# Altium project SMARTBOX.PrjPCB
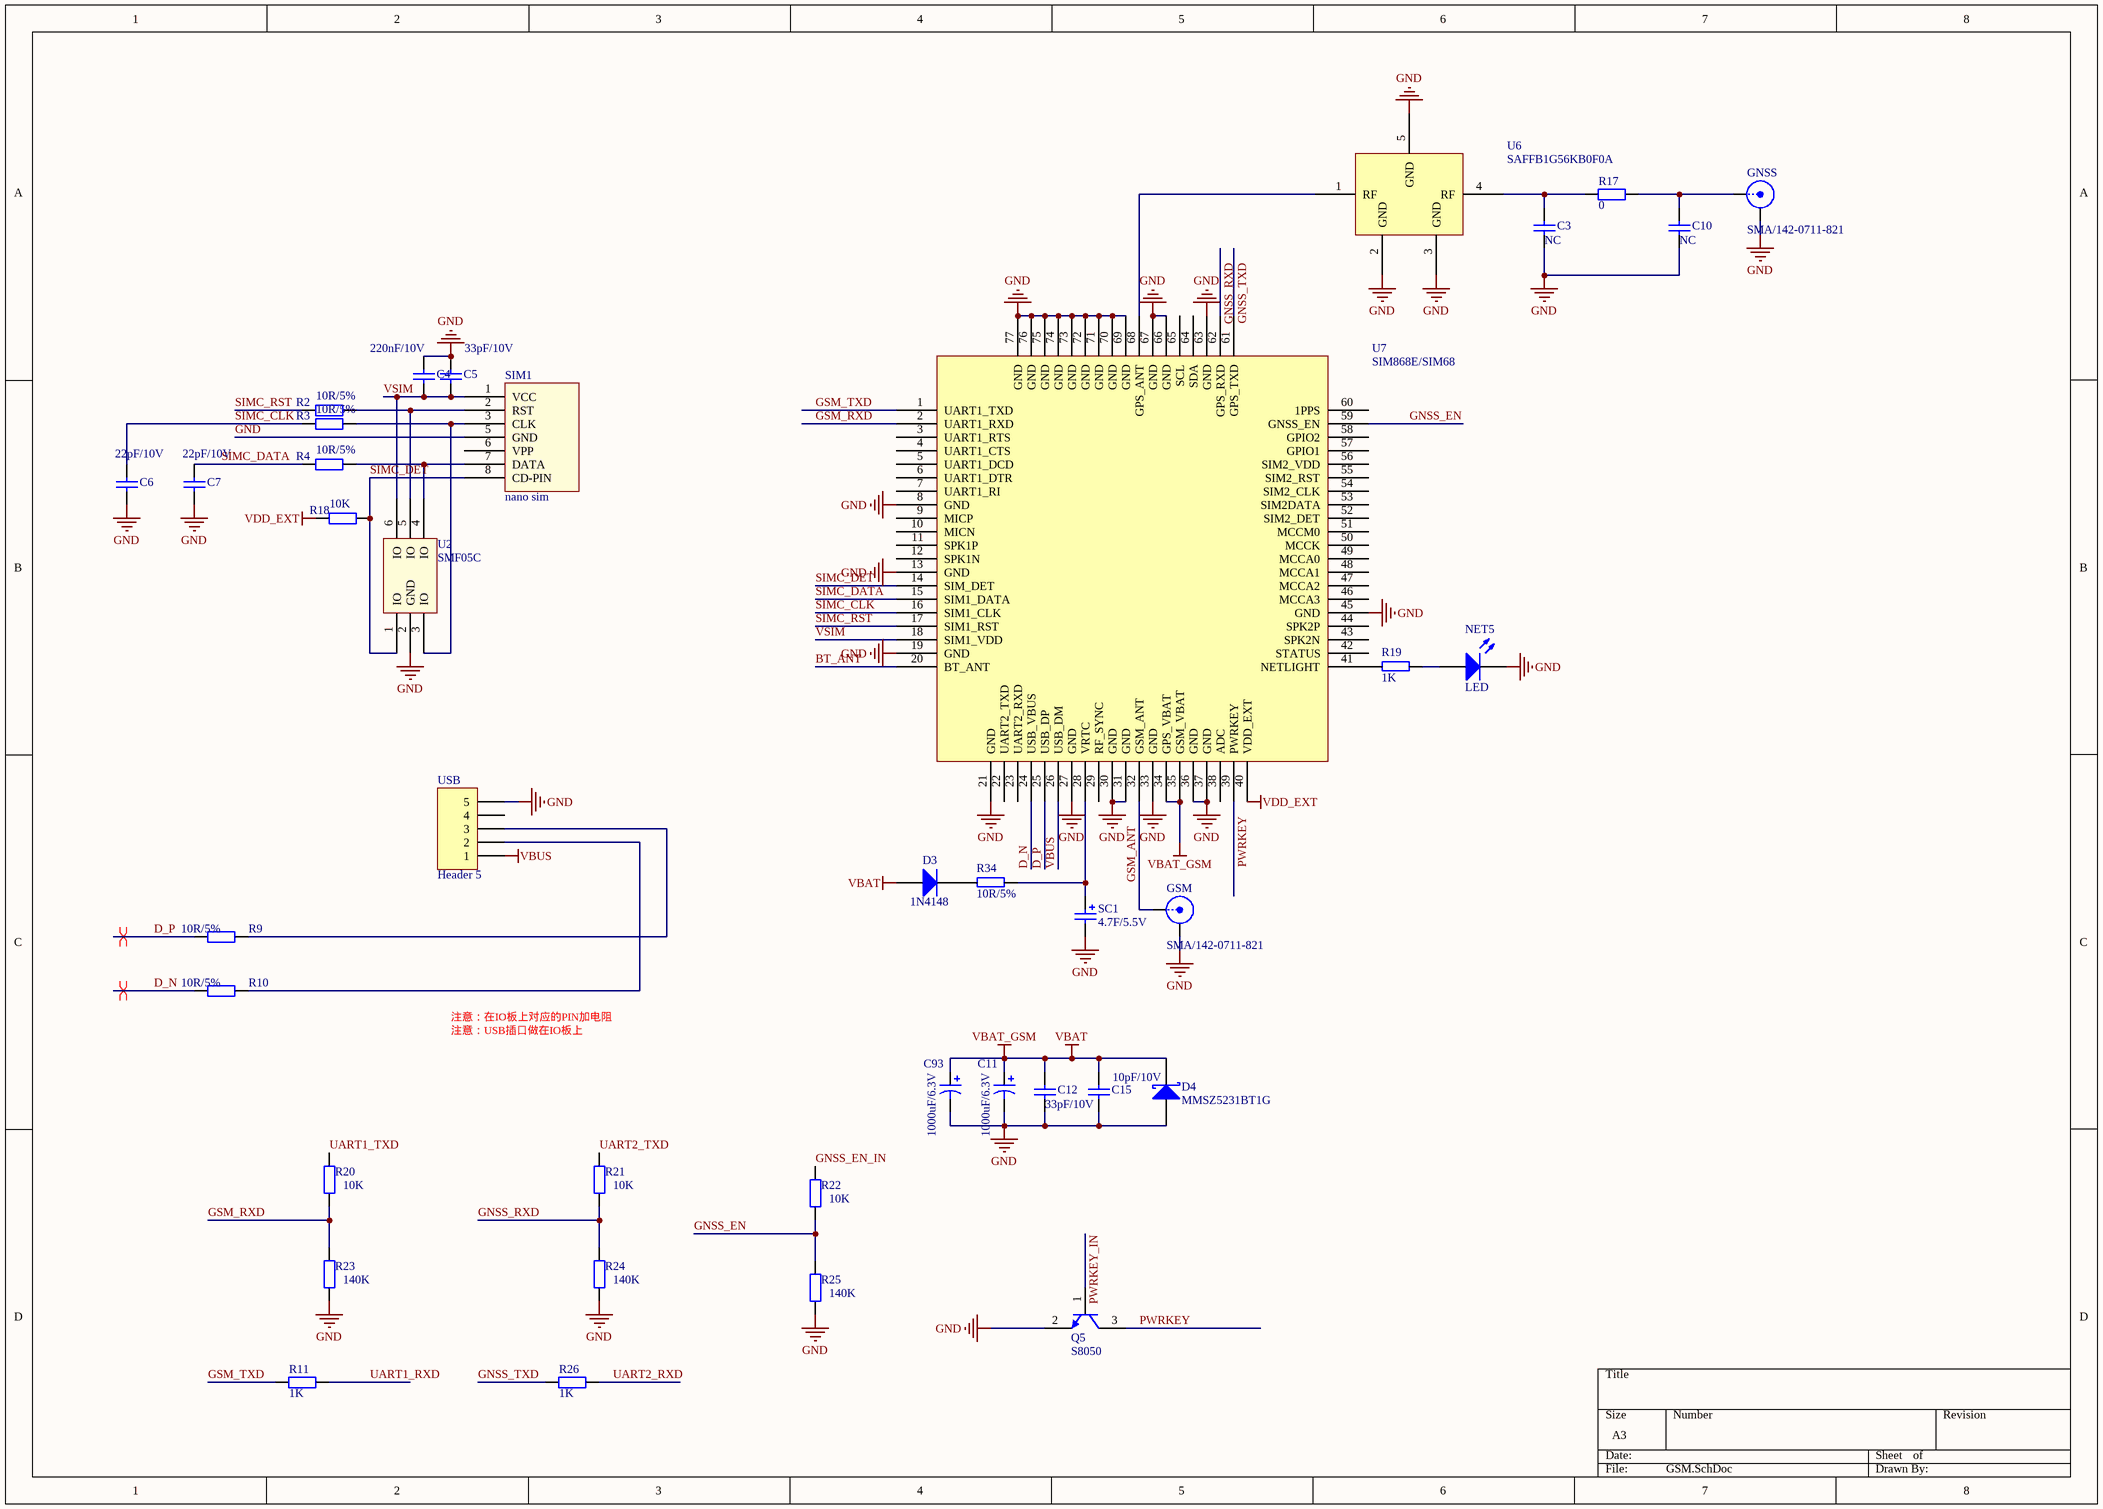
[diagram p0: GSM.SchDoc]
3 sheets, 91 parts. Net scope: global (net labels, ports and power ports of the same name join across sheets).
Board file: smartbox.PcbDoc
Sheets:
  GSM.SchDoc
  POWER.SchDoc
  CPU.SchDoc

## Sheet GSM.SchDoc
size A3

### Parts
C3  NC  [0603C]
C4  220nF/10V  [0603C]
C5  33pF/10V  [0603C]
C6  22pF/10V  [0603C]
C7  22pF/10V  [0603C]
C10  NC  [0603C]
C11  1000uF/6.3V  [7343]
C12  33pF/10V  [0603C]
C15  10pF/10V  [0603C]
C93  1000uF/6.3V  [7343]
D3  1N4148  [LL34]
D4  MMSZ5231BT1G  [SOD123]
GNSS  SMA/142-0711-821  [SMA END LAUNCH JACK RECEPTACLE SHORT]
GSM  SMA/142-0711-821  [SMA END LAUNCH JACK RECEPTACLE SHORT]
NET5  LED  [0603LED]
Q5  S8050  [SOT23-3]
R2  10R/5%  [0603R]
R3  10R/5%  [0603R]
R4  10R/5%  [0603R]
R9  10R/5%  [0603R]
R10  10R/5%  [0603R]
R11  1K  [0603R]
R17  0  [0603R]
R18  10K  [0603R]
R19  1K  [0603r]
R20  10K  [0603R]
R21  10K  [0603R]
R22  10K  [0603R]
R23  140K  [0603R]
R24  140K  [0603R]
R25  140K  [0603R]
R26  1K  [0603R]
R34  10R/5%  [0603r]
SC1  4.7F/5.5V  [SF-13.5*6.5]
SIM1  nano sim  [Nano SIM]
U2  SMF05C  [SC70-6L]
U6  SAFFB1G56KB0F0A  [SAFFB1G56KB0F0A]
U7  SIM868E/SIM68  [SIM868]
USB  Header 5  [Micro_USB_PH]

### Nets
GND: C3.2 C4.1 C5.1 C6.2 C7.2 C10.2 C11.2 C12.2 C15.2 C93.2 D4.A GNSS.2(GND) GSM.2(GND) NET5.2(K) Q5.2(E) R23.2 R24.2 R25.2 SC1.2 SIM1.5(GND) U2.2(GND) U6.2(GND) U6.3(GND) U6.5(GND) U7.8(GND) U7.13(GND) U7.19(GND) U7.21(GND) U7.27(GND) U7.30(GND) U7.31(GND) U7.33(GND) U7.36(GND) U7.37(GND) U7.45(GND) U7.63(GND) U7.66(GND) U7.67(GND) U7.69(GND) U7.70(GND) U7.71(GND) U7.72(GND) U7.73(GND) U7.74(GND) U7.75(GND) U7.76(GND) U7.77(GND) USB.5
VBAT: C11.1 C12.1 C15.1 C93.1 D3.1(A) D4.K U7.34(GPS_VBAT) U7.35(GSM_VBAT)  [also labelled VBAT_GSM]
VBUS: U7.26(USB_DM) USB.1
VDD_EXT: R18.2 U7.40(VDD_EXT)
BT_ANT: U7.20(BT_ANT)
D_N: R10.1 U7.24(USB_VBUS)
D_P: R9.1 U7.25(USB_DP)
GNSS_EN: R22.2 R25.1 U7.59(GNSS_EN)
GNSS_EN_IN: R22.1
GNSS_RXD: R21.2 R24.1 U7.62(GPS_RXD)
GNSS_TXD: R26.1 U7.61(GPS_TXD)
GSM_ANT: GSM.1(Signal) U7.32(GSM_ANT)
GSM_RXD: R20.2 R23.1 U7.2(UART1_RXD)
GSM_TXD: R11.1 U7.1(UART1_TXD)
PWRKEY: Q5.3(C) U7.39(PWRKEY)
PWRKEY_IN: Q5.1(B)
SIMC_CLK: C6.1 R3.2 U7.16(SIM1_CLK)
SIMC_DATA: C7.1 R4.2 U7.15(SIM1_DATA)
SIMC_DET: R18.1 SIM1.8(CD-PIN) U2.1(IO) U7.14(SIM_DET)
SIMC_RST: R2.2 U7.17(SIM1_RST)
UART1_RXD: R11.2
UART1_TXD: R20.1
UART2_RXD: R26.2
UART2_TXD: R21.1
VSIM: C4.2 C5.2 SIM1.1(VCC) U2.6(IO) U7.18(SIM1_VDD)
NetC3_1: C3.1 R17.1 U6.4(RF)
NetC10_1: C10.1 GNSS.1(Signal) R17.2
NetD3_2: D3.2(K) R34.2
NetNET5_1: NET5.1(A) R19.1
NetR2_1: R2.1 SIM1.2(RST) U2.5(IO)
NetR3_1: R3.1 SIM1.3(CLK) U2.3(IO)
NetR4_1: R4.1 SIM1.7(DATA) U2.4(IO)
NetR9_2: R9.2 USB.3
NetR10_2: R10.2 USB.2
NetR19_2: R19.2 U7.41(NETLIGHT)
NetR34_1: R34.1 SC1.1 U7.28(VRTC)
NetU6_1: U6.1(RF) U7.68(GPS_ANT)

Not connected (* = marked no-connect by the designer): SIM1 6(VPP); U7 3(UART1_RTS) 4(UART1_CTS) 5(UART1_DCD) 6(UART1_DTR) 7(UART1_RI) 9(MICP) 10(MICN) 11(SPK1P) 12(SPK1N) 22(UART2_TXD) 23(UART2_RXD) 29(RF_SYNC) 38(ADC) 42(STATUS) 43(SPK2N) 44(SPK2P) 46(MCCA3) 47(MCCA2) 48(MCCA1) 49(MCCA0) 50(MCCK) 51(MCCM0) 52(SIM2_DET) 53(SIM2DATA) 54(SIM2_CLK) 55(SIM2_RST) 56(SIM2_VDD) 57(GPIO1) 58(GPIO2) 60(1PPS) 64(SDA) 65(SCL); USB 4

### Layout directives
differential pair: D_N, D_P

### Notes on the sheet
- 注意：在IO板上对应的PIN加电阻
- 注意：USB插口做在IO板上

### Library data of the parts
C3-C7 C10 C12 C15 = Cap: Capacitor; Value: 0.1uF/10V; Published: 8-Jun-2000; LatestRevisionDate: 17-Jul-2002; LatestRevisionNote: Re-released for DXP Platform.; PackageReference: RAD-0.3; Publisher: Altium Limited
C11 C93 = Cap Pol1: Polarized Capacitor (Radial); Published: 8-Jun-2000; LatestRevisionDate: 17-Jul-2002; LatestRevisionNote: Re-released for DXP Platform.; PackageReference: RB7.6-15; Publisher: Altium Limited
D3 = Diode 1N4148: High Conductance Fast Diode; Published: 8-Jun-2000; LatestRevisionDate: 17-Jul-2002; LatestRevisionNote: Re-released for DXP Platform.; DatasheetVersion: 1997; PackageReference: DO-35; Publisher: Altium Limited; Code_JEDEC: DO-204-AH; ComponentLink1Description: Manufacturer Link; ComponentLink1URL: http://www.fairchildsemi.com/; ComponentLink2Description: Datasheet; ComponentLink2URL: http://www.fairchildsemi.com/ds/1N%2F1N4148.pdf
D4 = Diode 10TQ040: Schottky Rectifier; Note: Terminal 2 is the TAB and is electrically connected to the cathode; Published: 8-Jun-2000; LatestRevisionDate: 17-Jul-2002; LatestRevisionNote: Re-released for DXP Platform.; DatasheetVersion: PD-2.057B; PackageVersion: Feb-1998; PackageReference: TO-220AC; Publisher: Altium Limited; ComponentLink1Description: Manufacturer Link; ComponentLink1URL: http://www.irf.com/
GNSS GSM = SMA: SMA Straight Connector; LatestRevisionDate: 05-oct-2007  -  Semtech; LatestRevisionNote: Re-released for DXP Platform.; Publisher: Altium Limited
NET5 = LED2: Typical RED, GREEN, YELLOW, AMBER GaAs LED; Published: 8-Jun-2000; LatestRevisionDate: 17-Jul-2002; LatestRevisionNote: Re-released for DXP Platform.; PackageDocument: Feb-2002; PackageReference: 3.2X1.6X1.1; Publisher: Altium Limited
Q5 = NPN
R2-R4 R18 = Res2: Resistor; Value: 10R; Published: 8-Jun-2000; LatestRevisionDate: 17-Jul-2002; LatestRevisionNote: Re-released for DXP Platform.; PackageReference: AXIAL-0.4; Publisher: Altium Limited
R9 R10 = Resistor: Resistor SMD - IEC symbol version; Value: NC; LatestRevisionDate: 27-Jul-20  -  Semtech
R11 R20-R26 = Res2: Resistor; Value: 0; Published: 8-Jun-2000; LatestRevisionDate: 17-Jul-2002; LatestRevisionNote: Re-released for DXP Platform.; PackageReference: AXIAL-0.4; Publisher: Altium Limited
R17 = Res2: Resistor; Published: 8-Jun-2000; LatestRevisionDate: 17-Jul-2002; LatestRevisionNote: Re-released for DXP Platform.; PackageReference: AXIAL-0.4; Publisher: Altium Limited; Value: 0
R19 R34 = R
SC1 = Cap Pol2: Polarized Capacitor (Axial); Value: 100pF; Published: 8-Jun-2000; LatestRevisionDate: 17-Jul-2002; LatestRevisionNote: Re-released for DXP Platform.; PackageReference: POLAR0.8; Publisher: Altium Limited
U6 = SAFFB1G56KBOFA
U7 = SIM868E/SIM868
USB = Header 5: Header, 5-Pin; LatestRevisionDate: 17-Jul-2002; LatestRevisionNote: Re-released for DXP Platform.; Publisher: Altium Limited

## Sheet POWER.SchDoc
size A4
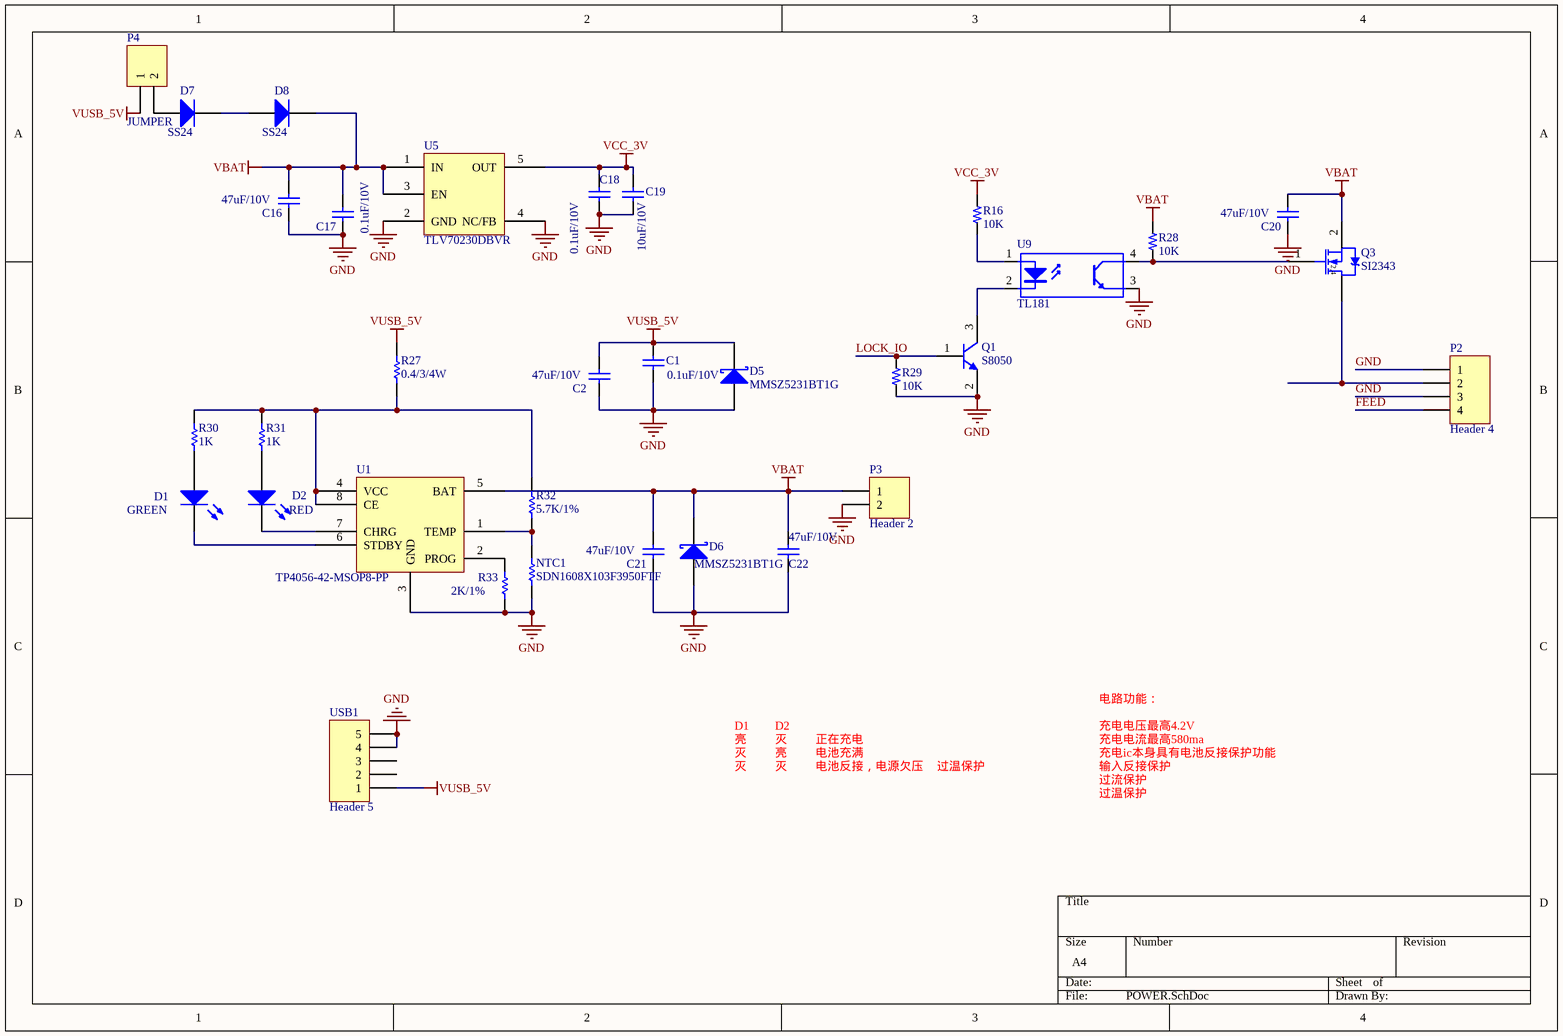
[diagram p1: POWER.SchDoc]

### Parts
C1  0.1uF/10V  [0603C]
C2  47uF/10V  [2220C]
C16  47uF/10V  [2220C]
C17  0.1uF/10V  [0603C]
C18  0.1uF/10V  [0603C]
C19  10uF/10V  [0603C]
C20  47uF/10V  [2220C]
C21  47uF/10V  [2220C]
C22  47uF/10V  [2220C]
D1  Publisher: GREEN  [0603LED]
D2  Publisher: RED  [0603LED]
D5  MMSZ5231BT1G  [SOD123]
D6  MMSZ5231BT1G  [SOD123]
D7  SS24  [SMA]
D8  SS24  [SMA]
NTC1  SDN1608X103F3950FTF  [0603R]
P2  Header 4  [HDR1X4]
P3  Header 2  [2X2.54MMZ]
P4  JUMPER  [HDR1X2]
Q1  S8050  [SOT23-3]
Q3  SI2343  [SOT23-3]
R16  10K  [0603R]
R27  0.4/3/4W  [2010R]
R28  10K  [0603R]
R29  10K  [0603R]
R30  1K  [0603R]
R31  1K  [0603R]
R32  5.7K/1%  [0603R]
R33  2K/1%  [0603R]
U1  TP4056-42-MSOP8-PP  [SOP65P490X265-8N]
U5  TLV70230DBVR  [SOT23-5(DBV)]
U9  TL181  [DIP-4]
USB1  Header 5  [USB-A]

### Nets
GND: C1.1 C2.1 C16.1 C17.2 C18.2 C19.1 C20.1 C21.1 C22.1 D5.A D6.A NTC1.2 P2.1 P2.3 P3.2 Q1.2(E) R29.1 R33.1 U1.3(GND) U5.2(GND) U5.4(NC/FB) U9.3(E) USB1.4 USB1.5
VBAT: C16.2 C17.1 C20.2 C21.2 C22.2 D6.K D8.2(K) P3.1 Q3.2(S) R28.2 U1.5(BAT) U5.1(IN) U5.3(EN)
VCC_3V: C18.1 C19.2 R16.2 U5.5(OUT)
VUSB_5V: C1.2 C2.2 D5.K P4.1 R27.1 USB1.1
FEED: P2.4
LOCK_IO: Q1.1(B) R29.2
NetD1_1: D1.1(A) R30.1
NetD1_2: D1.2(K) U1.6(STDBY)
NetD2_1: D2.1(A) R31.1
NetD2_2: D2.2(K) U1.7(CHRG)
NetD7_1: D7.1(A) P4.2
NetD7_2: D7.2(K) D8.1(A)
NetNTC1_1: NTC1.1 R32.2 U1.1(TEMP)
NetP2_2: P2.2 Q3.3(D)
NetQ1_3: Q1.3(C) U9.2(K)
NetQ3_1: Q3.1(G) R28.1 U9.4(C)
NetR16_1: R16.1 U9.1(A)
NetR27_2: R27.2 R30.2 R31.2 R32.1 U1.4(VCC) U1.8(CE)
NetR33_2: R33.2 U1.2(PROG)

Not connected (* = marked no-connect by the designer): USB1 2 3

### Notes on the sheet
- 电路功能：
- D1
- 亮
- 灭
- D2
- 正在充电
- 电池充满
- 电池反接，电源欠压
- 过温保护
- 充电ic本身具有电池反接保护功能
- 输入反接保护
- 充电电流最高580ma
- 充电电压最高4.2V
- 过流保护
- (in symbol BUK92150-55A) 2,4

### Library data of the parts
C1 = Cap: Capacitor; Value: 100pF; Published: 8-Jun-2000; LatestRevisionDate: 17-Jul-2002; LatestRevisionNote: Re-released for DXP Platform.; PackageReference: RAD-0.3; Publisher: Altium Limited
C2 C16 C20-C22 = Cap: Capacitor; Value: 106/50V; Published: 8-Jun-2000; LatestRevisionDate: 17-Jul-2002; LatestRevisionNote: Re-released for DXP Platform.; PackageReference: RAD-0.3; Publisher: Altium Limited
C17 C18 = Cap: Capacitor; Value: 104; Published: 8-Jun-2000; LatestRevisionDate: 17-Jul-2002; LatestRevisionNote: Re-released for DXP Platform.; PackageReference: RAD-0.3; Publisher: Altium Limited
C19 = Cap: Capacitor; Published: 8-Jun-2000; LatestRevisionDate: 17-Jul-2002; LatestRevisionNote: Re-released for DXP Platform.; PackageReference: RAD-0.3; Publisher: Altium Limited; Value: 10uF/10V
D1 D2 = LED0: Typical INFRARED GaAs LED; Published: 8-Jun-2000; LatestRevisionDate: 08-Jul-2005; LatestRevisionNote: Mech Layer 1 removed.; PackageReference: LED-0
D5 D6 = Diode 10TQ040: as D4 on sheet GSM; Published: 8-Jun-2000; LatestRevisionDate: 17-Jul-2002; LatestRevisionNote: Re-released for DXP Platform.; DatasheetVersion: PD-2.057B; PackageVersion: Feb-1998; PackageReference: TO-220AC; Publisher: Altium Limited; ComponentLink1Description: Manufacturer Link; ComponentLink1URL: http://www.irf.com/
D7 D8 = Diode 1N4148: High Conductance Fast Diode; Published: 8-Jun-2000; LatestRevisionDate: 17-Jul-2002; LatestRevisionNote: Re-released for DXP Platform.; DatasheetVersion: 1997; PackageReference: DO-35; Publisher: Altium Limited; Code_JEDEC: DO-204-AH; ComponentLink1Description: Manufacturer Link; ComponentLink1URL: http://www.fairchildsemi.com/; ComponentLink2Description: Datasheet; ComponentLink2URL: http://www.fairchildsemi.com/ds/1N%2F1N4148.pdf
NTC1 R27 R32 R33 = Res Semi: Semiconductor Resistor; Value: 1K; Published: 8-Jun-2000; LatestRevisionDate: 17-Jul-2002; LatestRevisionNote: Re-released for DXP Platform.; PackageReference: AXIAL-0.5; Publisher: Altium Limited
P2 = Header 4: Header, 4-Pin; LatestRevisionDate: 17-Jul-2002; LatestRevisionNote: Re-released for DXP Platform.; Publisher: Altium Limited
P3 P4 = Header 2: Header, 2-Pin; LatestRevisionDate: 17-Jul-2002; LatestRevisionNote: Re-released for DXP Platform.; Publisher: Altium Limited
Q1 = NPN
Q3 = BUK92150-55A: Published: 8-Jun-2000; LatestRevisionDate: 17-Jul-2002; LatestRevisionNote: Re-released for DXP Platform.; DatasheetVersion: 6-Oct-1997; PackageVersion: Aug-1998; PackageReference: TSOP-6; Publisher: Altium Limited; PackageDescription: SOT-457/SC-74; 6 Leads; Body 3.1 x 3 mm, inc. leads (LxW max); ComponentLink1Description: Manufacturer Link; ComponentLink1URL: http://www.vishay.com/; ComponentLink2Description: Datasheet; ComponentLink2URL: http://www.vishay.com/docs/70192/70192.pdf
R16 R28 R29 = R
R30 R31 = Res Semi: Semiconductor Resistor; Published: 8-Jun-2000; LatestRevisionDate: 17-Jul-2002; LatestRevisionNote: Re-released for DXP Platform.; PackageReference: AXIAL-0.5; Publisher: Altium Limited; Value: 1K
U1 = TP4056
U9 = Optoisolator1: 4-Pin Phototransistor Optocoupler; Published: 24-Mar-1999; LatestRevisionDate: 04-Mar-2005; LatestRevisionNote: Sch pins 3 & 4 Swapped.; DatasheetVersion: Nov-2003; PackageReference: DIP-4; Publisher: Altium Limited
USB1 = Header 5: Header, 5-Pin; LatestRevisionDate: 17-Jul-2002; LatestRevisionNote: Re-released for DXP Platform.; Publisher: Altium Limited

## Sheet CPU.SchDoc
size A3
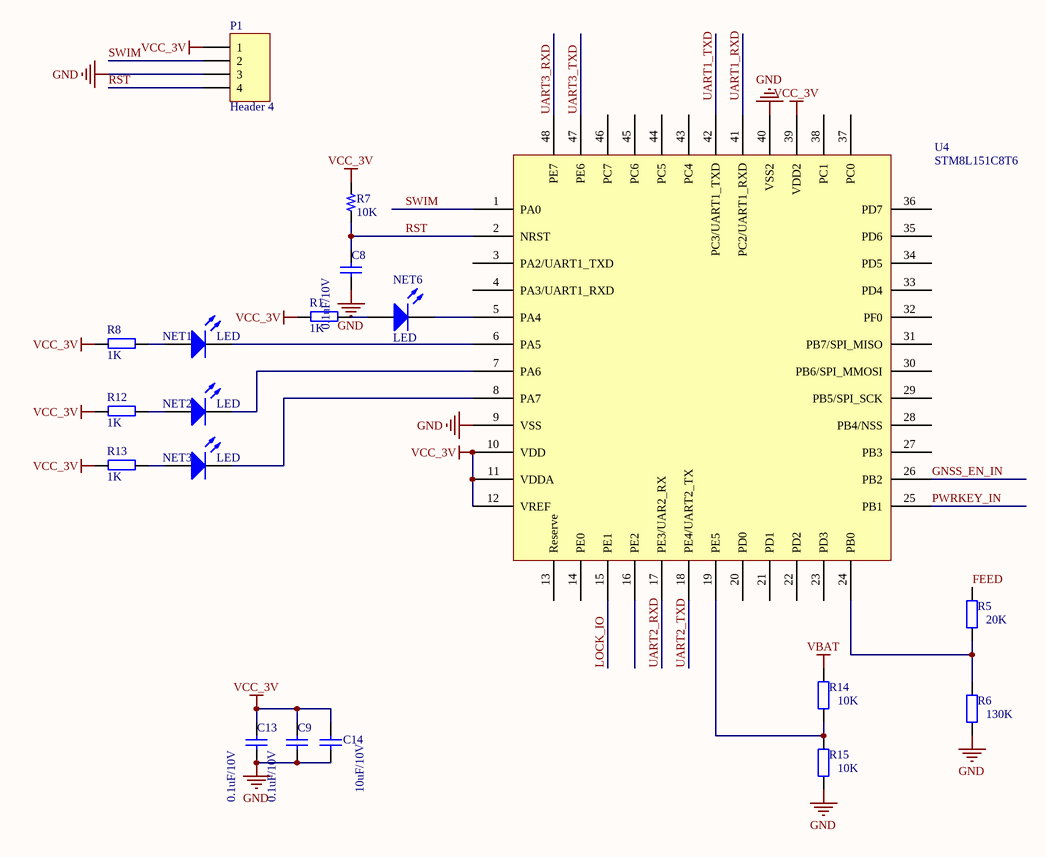
[diagram p2: CPU.SchDoc]

### Parts
C8  0.1uF/10V  [0603C]
C9  0.1uF/10V  [0603C]
C13  0.1uF/10V  [0603C]
C14  10uF/10V  [0603C]
NET1  LED  [0603LED]
NET2  LED  [0603LED]
NET3  LED  [0603LED]
NET6  LED  [0603LED]
P1  Header 4  [HDR1X4]
R1  1K  [0603r]
R5  20K  [0603R]
R6  130K  [0603R]
R7  10K  [0603R]
R8  1K  [0603r]
R12  1K  [0603r]
R13  1K  [0603r]
R14  10K  [0603R]
R15  10K  [0603R]
U4  STM8L151C8T6  [TQFP-48]

### Nets
GND: C8.2 C9.2 C13.2 C14.1 P1.3 R6.2 R15.2 U4.9(VSS) U4.40(VSS2)
VBAT: R14.1
VCC_3V: C9.1 C13.1 C14.2 P1.1 R1.2 R7.2 R8.2 R12.2 R13.2 U4.10(VDD) U4.11(VDDA) U4.12(VREF) U4.39(VDD2)
FEED: R5.1
GNSS_EN_IN: U4.26(PB2)
LOCK_IO: U4.15(PE1)
PWRKEY_IN: U4.25(PB1)
RST: C8.1 P1.4 R7.1 U4.2(NRST)
SWIM: P1.2 U4.1(PA0)
UART1_RXD: U4.41(PC2/UART1_RXD)
UART1_TXD: U4.42(PC3/UART1_TXD)
UART2_RXD: U4.17(PE3/UAR2_RX)
UART2_TXD: U4.18(PE4/UART2_TX)
UART3_RXD: U4.48(PE7)
UART3_TXD: U4.47(PE6)
NetNET1_1: NET1.1(A) R8.1
NetNET1_2: NET1.2(K) U4.6(PA5)
NetNET2_1: NET2.1(A) R12.1
NetNET2_2: NET2.2(K) U4.7(PA6)
NetNET3_1: NET3.1(A) R13.1
NetNET3_2: NET3.2(K) U4.8(PA7)
NetNET6_1: NET6.1(A) R1.1
NetNET6_2: NET6.2(K) U4.5(PA4)
NetR5_2: R5.2 R6.1 U4.24(PB0)
NetR14_2: R14.2 R15.1 U4.19(PE5)

Not connected (* = marked no-connect by the designer): U4 3(PA2/UART1_TXD) 4(PA3/UART1_RXD) 13(Reserve) 14(PE0) 16(PE2) 20(PD0) 21(PD1) 22(PD2) 23(PD3) 27(PB3) 28(PB4/NSS) 29(PB5/SPI_SCK) 30(PB6/SPI_MMOSI) 31(PB7/SPI_MISO) 32(PF0) 33(PD4) 34(PD5) 35(PD6) 36(PD7) 37(PC0) 38(PC1) 43(PC4) 44(PC5) 45(PC6) 46(PC7)

### Library data of the parts
C8 C9 C13 = Cap: Capacitor; Value: 104; Published: 8-Jun-2000; LatestRevisionDate: 17-Jul-2002; LatestRevisionNote: Re-released for DXP Platform.; PackageReference: RAD-0.3; Publisher: Altium Limited
C14 = Cap: Capacitor; Published: 8-Jun-2000; LatestRevisionDate: 17-Jul-2002; LatestRevisionNote: Re-released for DXP Platform.; PackageReference: RAD-0.3; Publisher: Altium Limited; Value: 10uF/10V
NET1-NET3 NET6 = LED2: as NET5 on sheet GSM; Published: 8-Jun-2000; LatestRevisionDate: 17-Jul-2002; LatestRevisionNote: Re-released for DXP Platform.; PackageDocument: Feb-2002; PackageReference: 3.2X1.6X1.1; Publisher: Altium Limited
P1 = Header 4: Header, 4-Pin; LatestRevisionDate: 17-Jul-2002; LatestRevisionNote: Re-released for DXP Platform.; Publisher: Altium Limited
R1 R7 R8 R12 R13 = R
R5 R6 R14 R15 = Res2: Resistor; Value: 0; Published: 8-Jun-2000; LatestRevisionDate: 17-Jul-2002; LatestRevisionNote: Re-released for DXP Platform.; PackageReference: AXIAL-0.4; Publisher: Altium Limited

## Nets that join several sheets
GND: GSM (48 pins), POWER (24 pins), CPU (9 pins)
VBAT: GSM (8 pins), POWER (13 pins), CPU (R14.1)
VCC_3V: POWER (C18.1 C19.2 R16.2 U5.5), CPU (13 pins)
FEED: POWER (P2.4), CPU (R5.1)
GNSS_EN_IN: GSM (R22.1), CPU (U4.26)
LOCK_IO: POWER (Q1.1 R29.2), CPU (U4.15)
PWRKEY_IN: GSM (Q5.1), CPU (U4.25)
UART1_RXD: GSM (R11.2), CPU (U4.41)
UART1_TXD: GSM (R20.1), CPU (U4.42)
UART2_RXD: GSM (R26.2), CPU (U4.17)
UART2_TXD: GSM (R21.1), CPU (U4.18)